# Altium schematic sheet Block Diagram.SchDoc
size Letter; Organization: Midnight Sun Solar Rayce Car Team; Address1: University of Waterloo; Address2: 200 University Ave W; Address3: Waterloo, ON, Canada; Address4: N2L 3E9; Website: www.uwmidsun.com
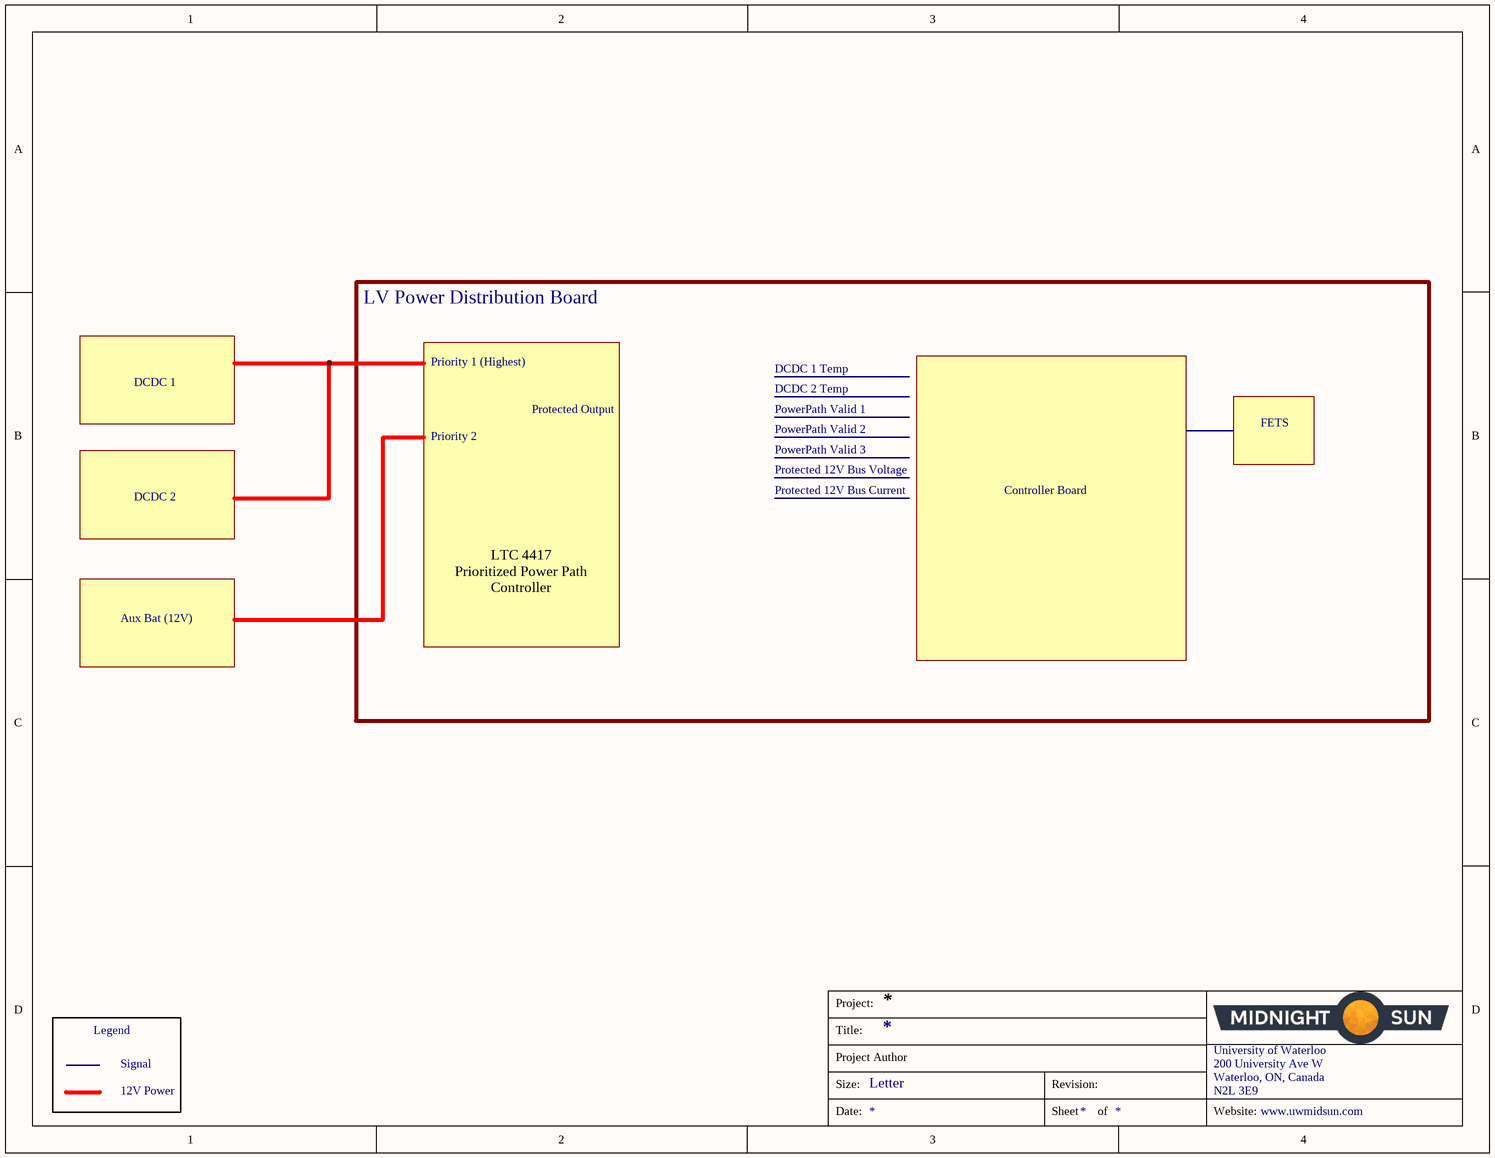
[diagram p0: Block Diagram.SchDoc]

## Notes on the sheet
- LV Power Distribution Board
- Priority 1 (Highest)
- DCDC 1 Temp
- DCDC 1
- Protected Output
- DCDC 2 Temp
- PowerPath Valid 1
- PowerPath Valid 2
- FETS
- DCDC 2
- Priority 2
- Protected 12V Bus Voltage
- Protected 12V Bus Current
- PowerPath Valid 3
- Controller Board
- Aux Bat (12V)
- LTC 4417
  Prioritized Power Path
  Controller
- Legend
- Signal
- 12V Power
- Project:
- Title:
- Size:
- Project Author
- Letter
- Revision:
- University of Waterloo
- 200 University Ave W
- Waterloo, ON, Canada
- N2L 3E9
- Date:
- Sheet
- of
- Website: